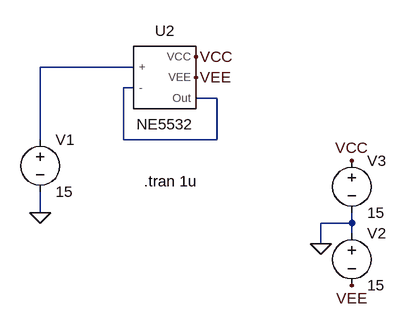
[diagram p0: schematic Test (If Spice works) NE5532.asc]
Test (If Spice works) NE5532.asc, the LTspice schematic file:
Version 4.1
SHEET 1 880 680
WIRE 160 80 16 80
WIRE 160 112 144 112
WIRE 288 128 256 128
WIRE 16 192 16 80
WIRE 144 192 144 112
WIRE 288 192 288 128
WIRE 288 192 144 192
WIRE 16 304 16 272
WIRE 496 320 496 304
WIRE 496 320 448 320
WIRE 496 336 496 320
WIRE 448 352 448 320
FLAG 448 352 0
FLAG 256 64 VCC
FLAG 496 224 VCC
FLAG 256 96 VEE
FLAG 496 416 VEE
FLAG 16 304 0
SYMBOL voltage 16 176 R0
WINDOW 123 0 0 Left 0
WINDOW 39 0 0 Left 0
SYMATTR InstName V1
SYMATTR Value 15
SYMBOL voltage 496 320 R0
WINDOW 123 0 0 Left 0
WINDOW 39 0 0 Left 0
SYMATTR InstName V2
SYMATTR Value 15
SYMBOL voltage 496 208 R0
WINDOW 123 0 0 Left 0
WINDOW 39 0 0 Left 0
SYMATTR InstName V3
SYMATTR Value 15
SYMBOL ZmySymbol\\OP-Amps\\NE5532 208 96 R0
SYMATTR InstName U2
TEXT 176 256 Left 2 !.tran 1u

The netlist it stands for:
* Test (If Spice works) NE5532.asc
V1 N001 0 15
V2 0 VEE 15
V3 VCC 0 15
X§U2 N001 N002 VCC VEE N002 NE5532  ; pins + - VCC VEE Out
.tran 1u
.lib C:\Users\leonz\AppData\Local\Programs\ADI\LTspice\Circuits\D-Class_Amp-Buep\NE5532.lib
.backanno
.end